# EasyEDA Pro project ProPrj_OrcaSDVX_电路.epro, schematic 主控板V2

## Sheets
1 P1: Board Name: 1-主控板V2; Create Date: 2025-03-24; Page Name: P1; Project Name: OrcaSDVX; Schematic Name: 主控板V2; Update Date: 2025-04-11; Company: 嘉立创EDA; Page Size: A3; Version: V1.0
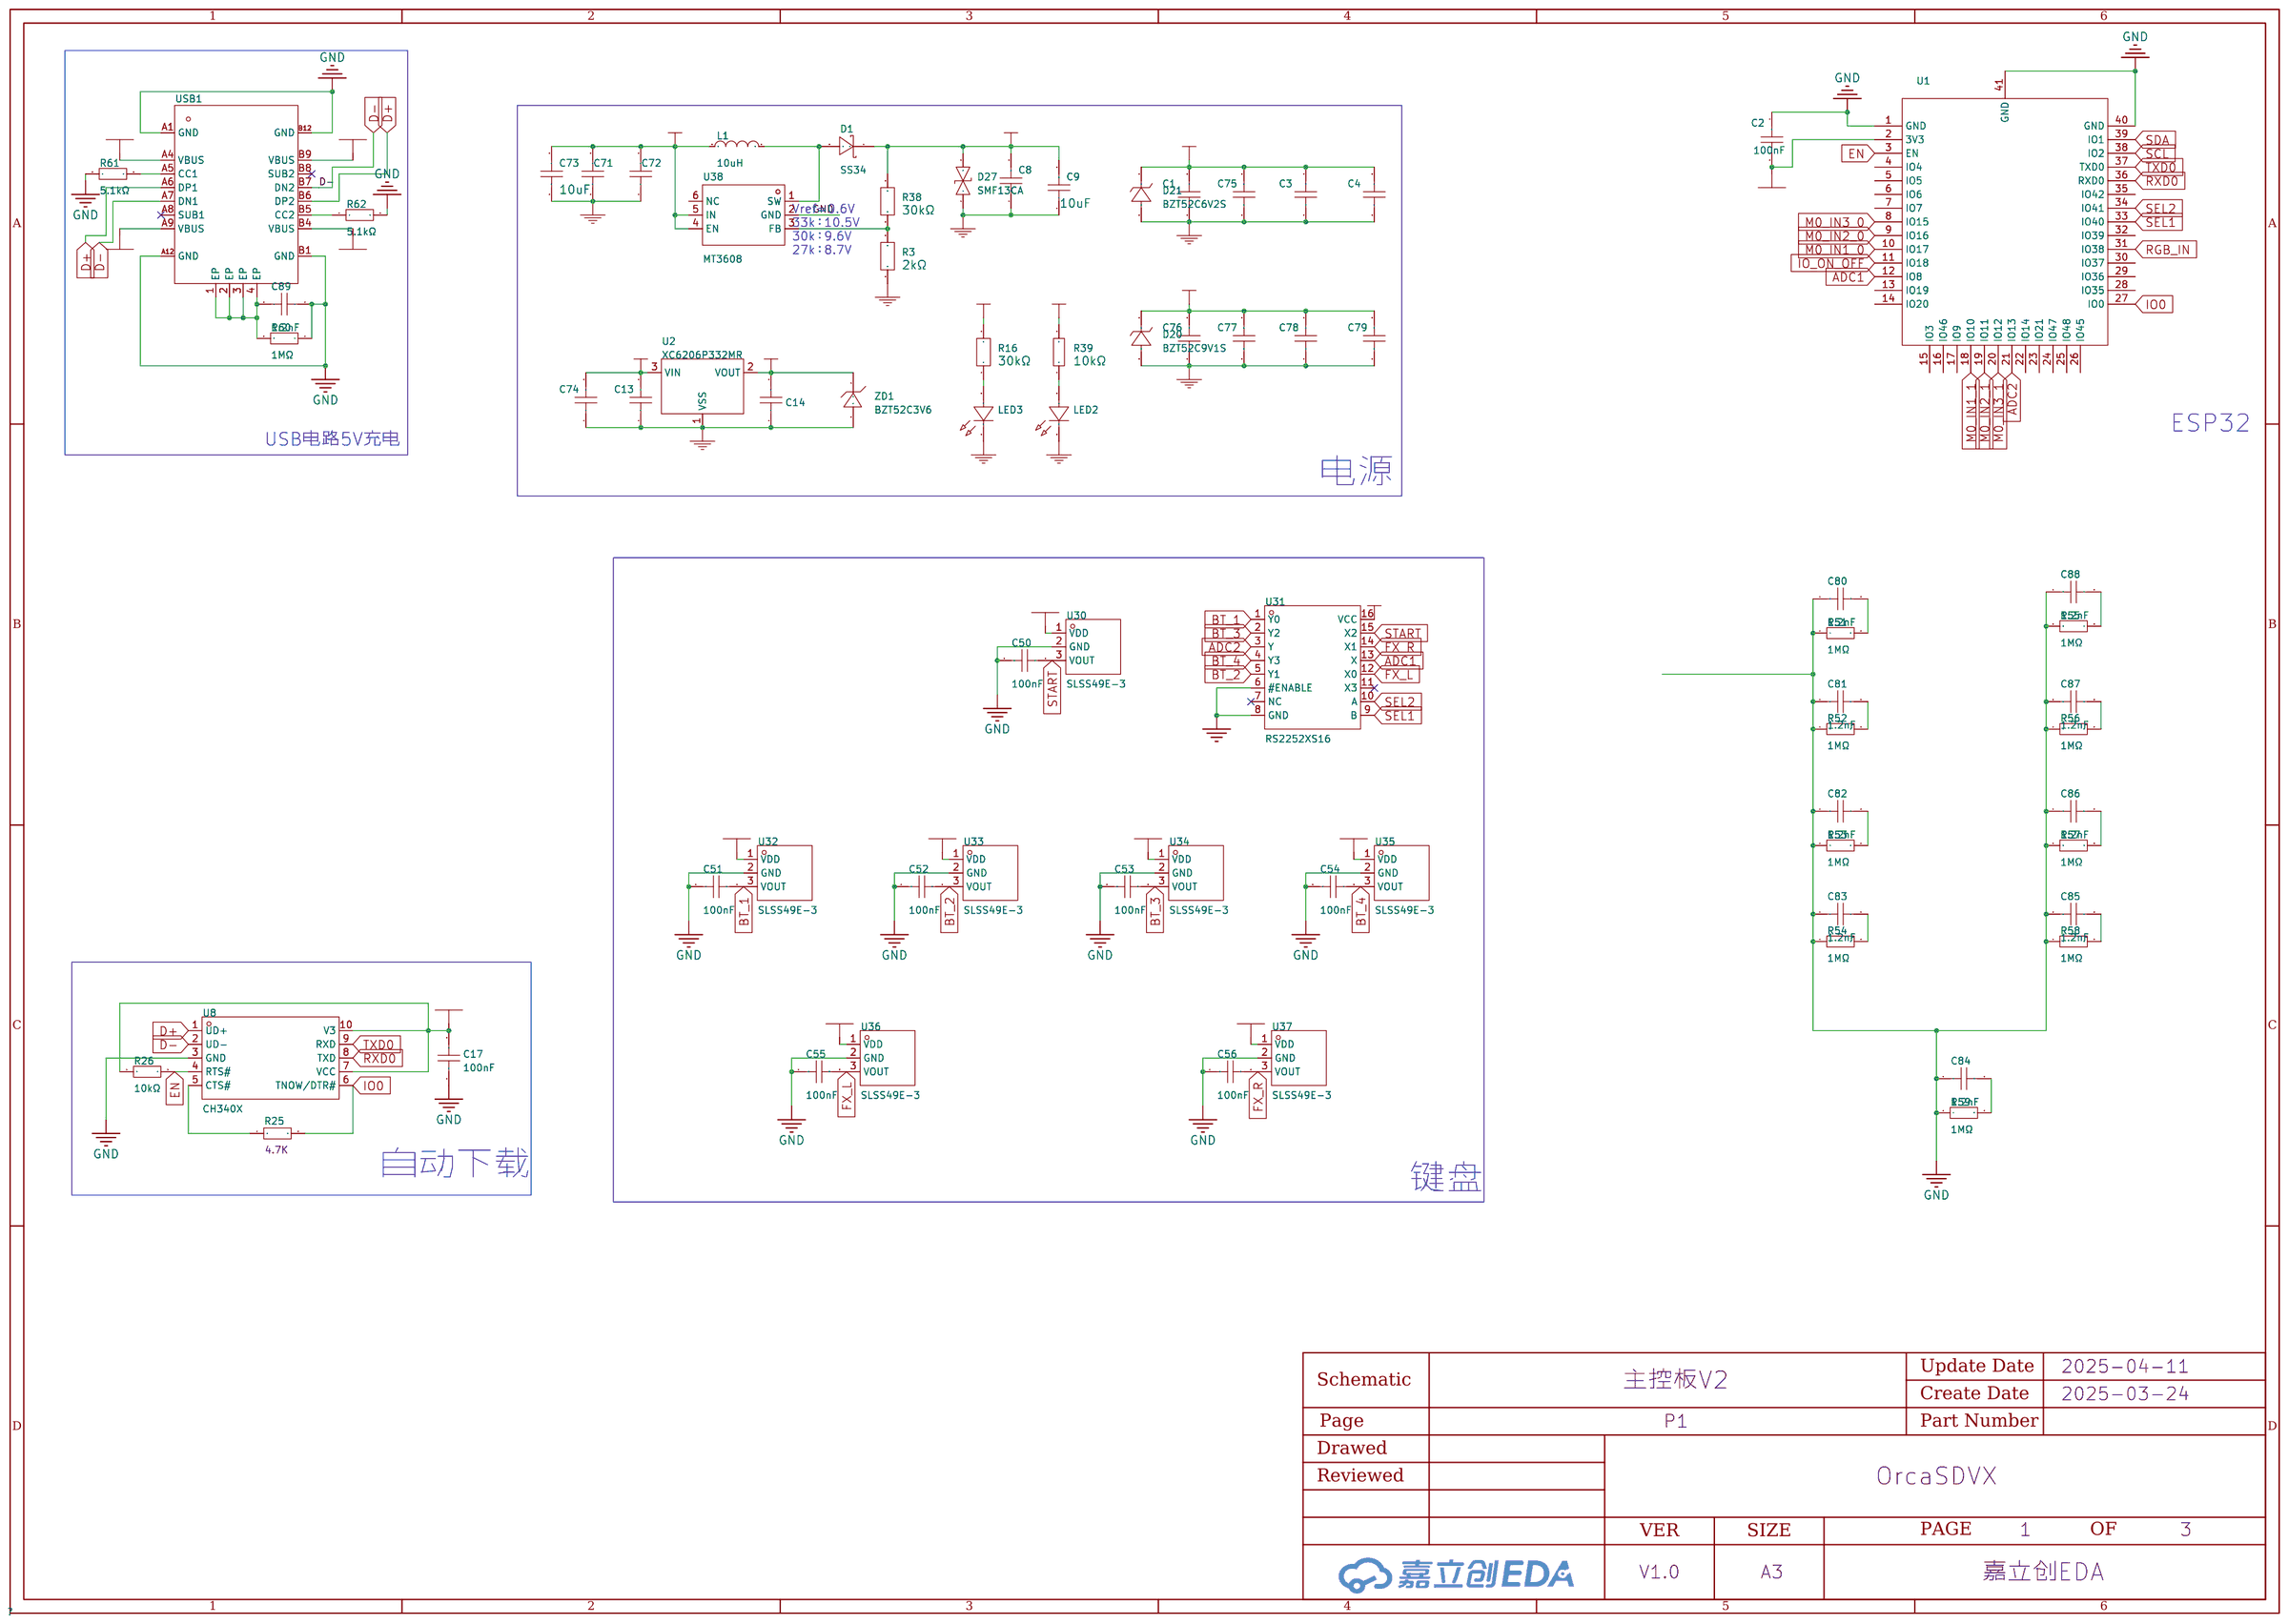
[diagram p0: P1]
2 电机驱动电路: Create Date: 2025-03-28; Page Name: 电机驱动电路; Update Date: 2025-04-10; Page Size: A4
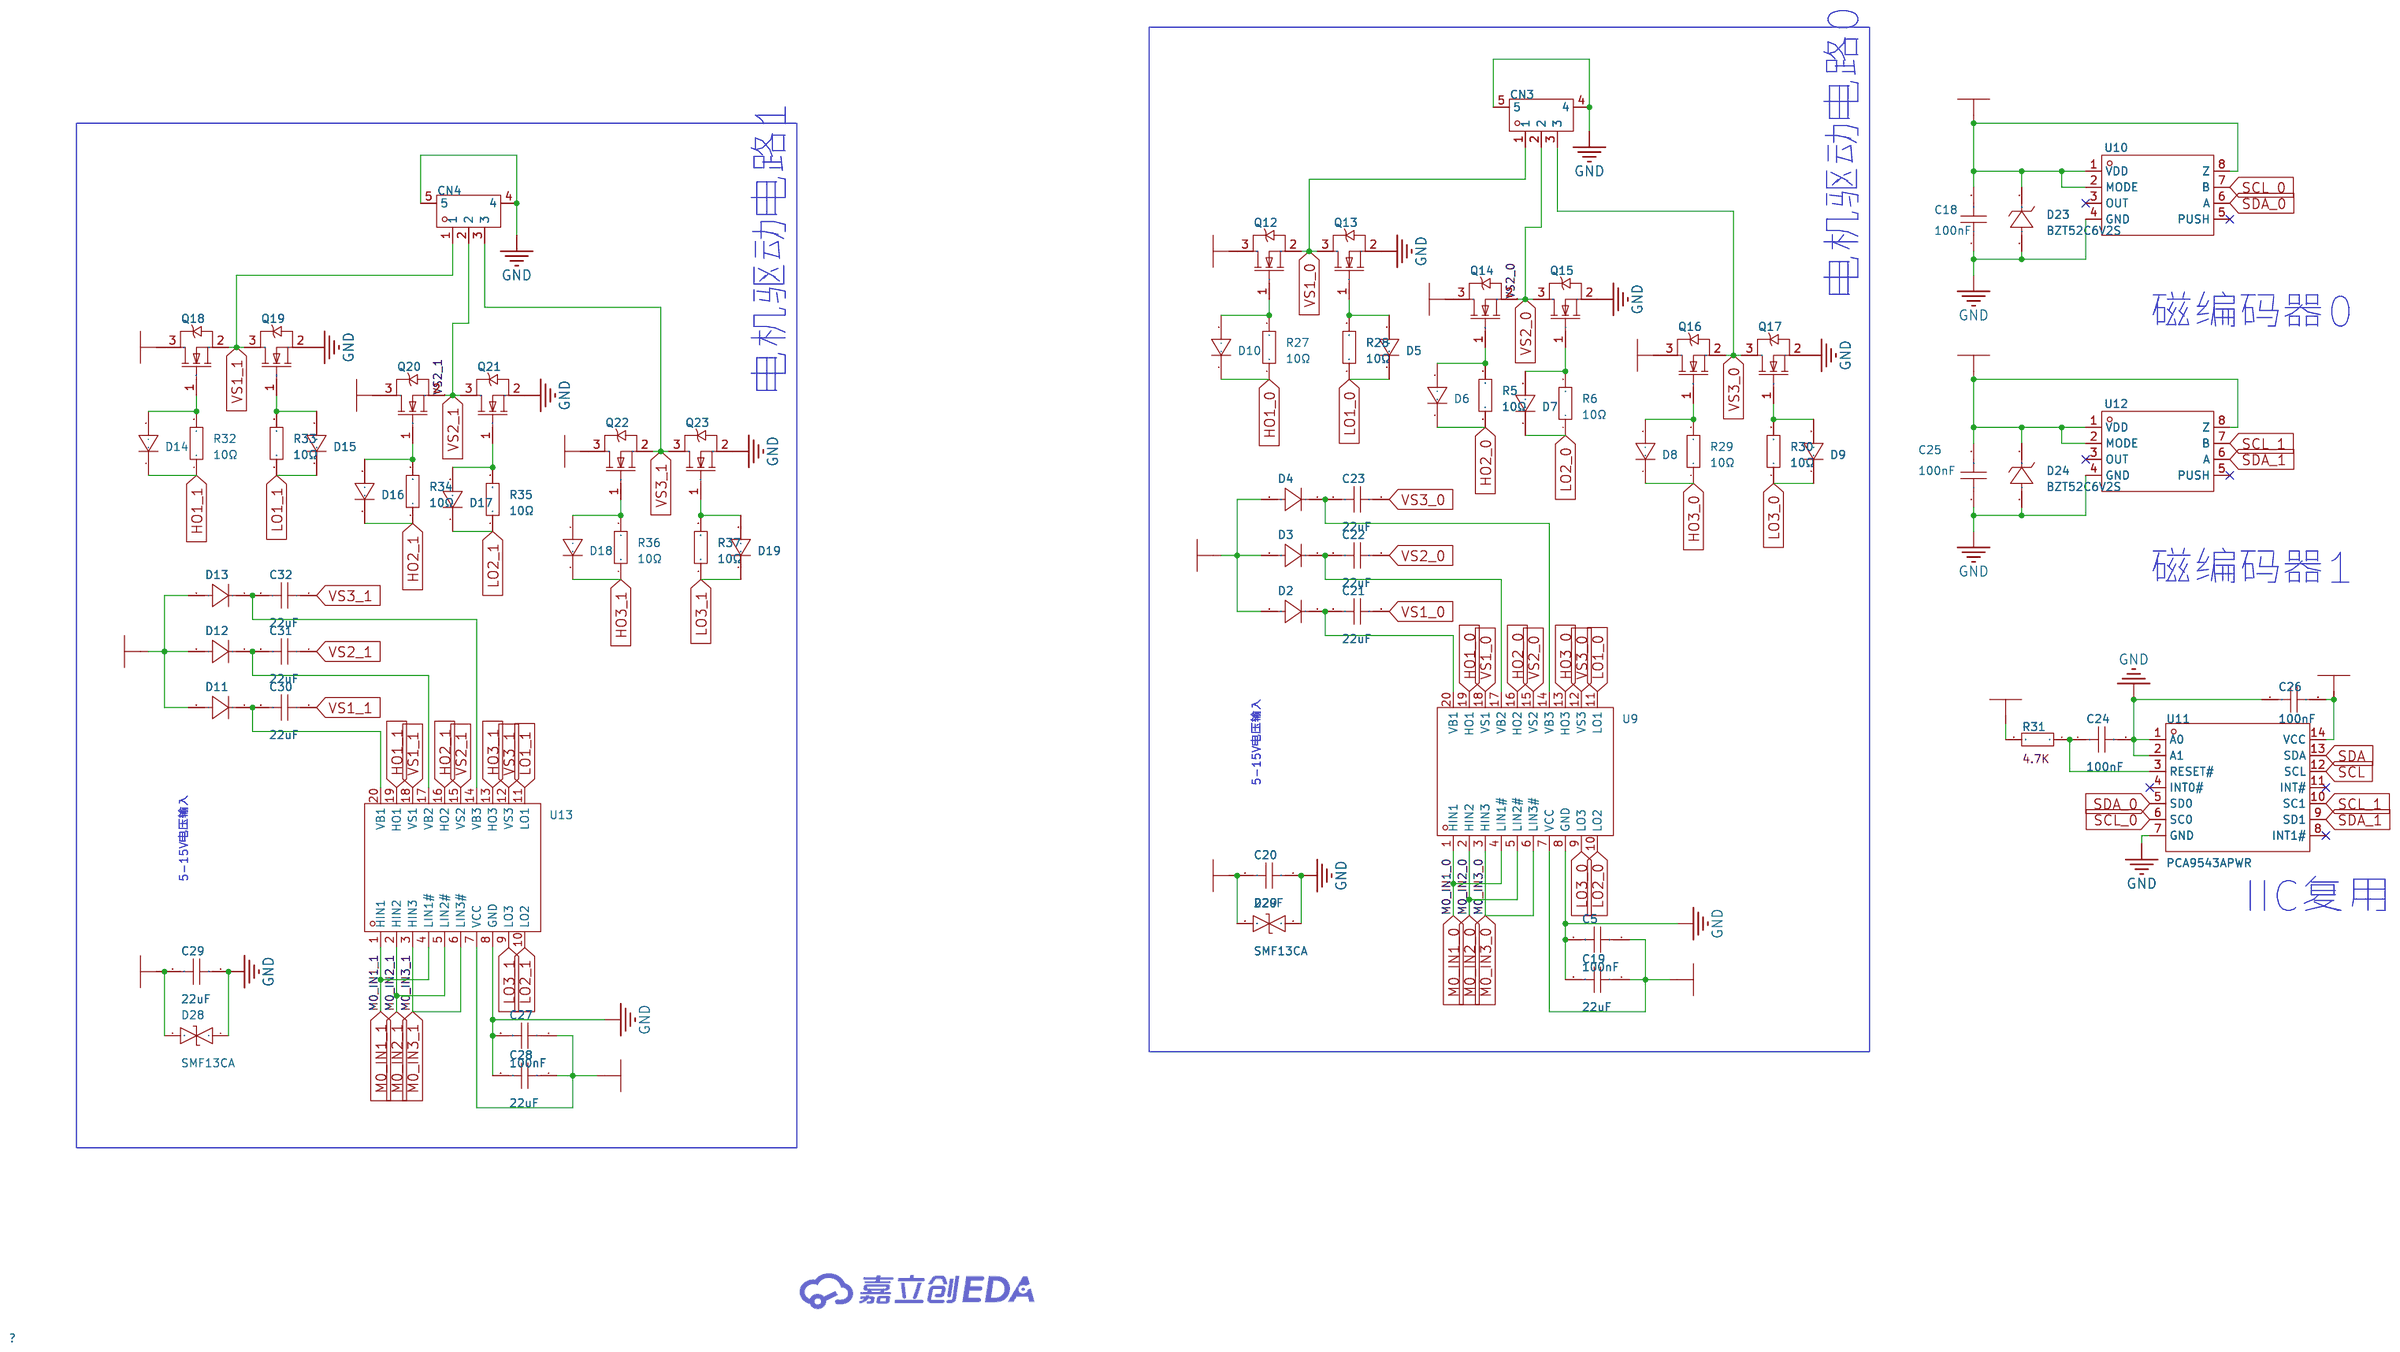
[diagram p1: 电机驱动电路]
3 灯: Create Date: 2025-03-28; Page Name: 灯; Project Name: OrcaSDVX_new; Update Date: 2025-03-28; Page Size: A4
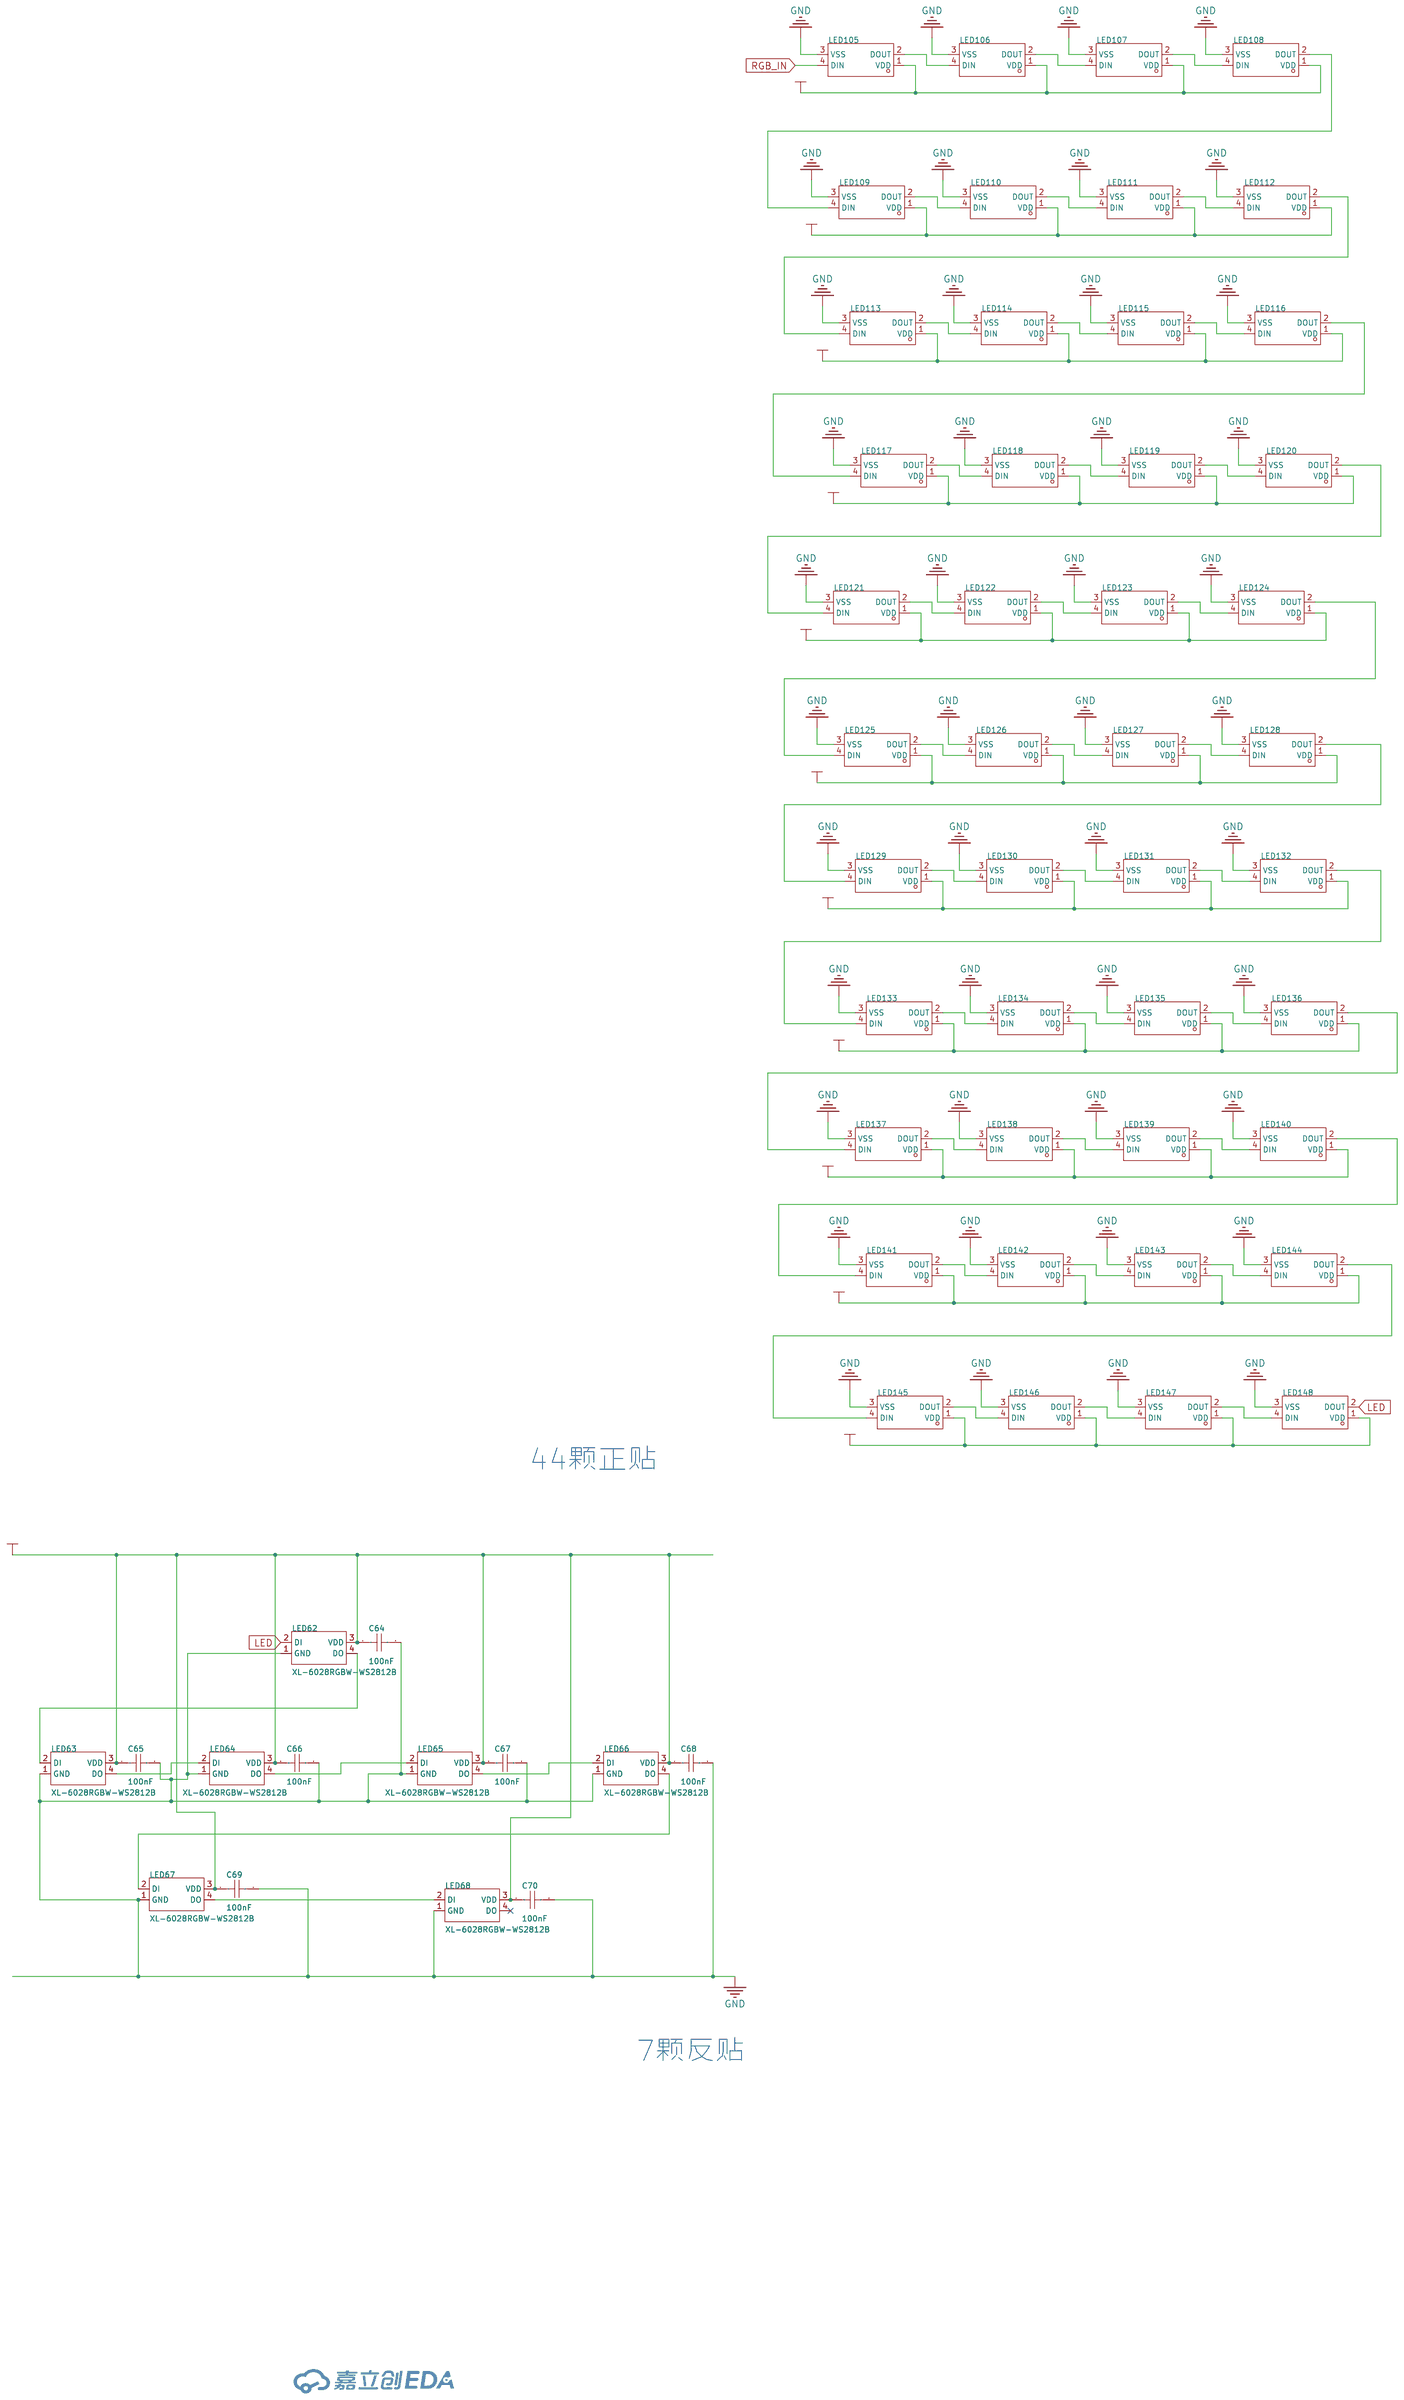
[diagram p2: 灯]

## Parts
sheet P1
C1  100nF  [C0402]
C2  100nF  [C0603]
C3  100nF  [C0402]
C4  100nF  [C0402]
C8  100nF  [C0402]
C9  10uF  [C0603]
C13  100nF  [C0402]
C14  100nF  [C0402]
C17  100nF  [C0603]
C50  100nF  [C0603]
C51  100nF  [C0603]
C52  100nF  [C0603]
C53  100nF  [C0603]
C54  100nF  [C0603]
C55  100nF  [C0603]
C56  100nF  [C0603]
C71  100nF  [C0402]
C72  100nF  [C0402]
C73  10uF  [C0603]
C74  100nF  [C0402]
C75  100nF  [C0402]
C76  100nF  [C0402]
C77  100nF  [C0402]
C78  100nF  [C0402]
C79  100nF  [C0402]
C80  1.2nF  [C1210]
C81  1.2nF  [C1210]
C82  1.2nF  [C1210]
C83  1.2nF  [C1210]
C84  1.2nF  [C1210]
C85  1.2nF  [C1210]
C86  1.2nF  [C1210]
C87  1.2nF  [C1210]
C88  1.2nF  [C1210]
C89  1.2nF  [C1210]
D1  SS34  [SMA_L4.3-W2.6-LS5.2-RD]
D20  BZT52C9V1S  [SOD-323_L1.7-W1.3-LS2.6-RD]
D21  BZT52C6V2S  [SOD-323_L1.7-W1.3-LS2.6-RD]
D27  SMF13CA  [SOD-123_L2.8-W1.8-LS3.7-BI-1]
L1  10uH  [IND-SMD_L3.0-W3.0_FTC303020D]
LED2  XL-1608UGC-04  [LED0603-RD_GREEN]
LED3  XL-1608UGC-04  [LED0603-RD_GREEN]
R3  2kΩ  [R0603]
R16  30kΩ  [R0603]
R25  -  [R0603]
R26  10kΩ  [R0603]
R38  30kΩ  [R0603]
R39  10kΩ  [R0402]
R51  1MΩ  [R2512]
R52  1MΩ  [R2512]
R53  1MΩ  [R2512]
R54  1MΩ  [R2512]
R55  1MΩ  [R2512]
R56  1MΩ  [R2512]
R57  1MΩ  [R2512]
R58  1MΩ  [R2512]
R59  1MΩ  [R2512]
R60  1MΩ  [R2512]
R61  5.1kΩ  [R0603]
R62  5.1kΩ  [R0603]
U1  ESP32-S3-WROOM-1U-N16R8  [WIRELM-SMD_ESP32-S3-WROOM-1U]
U2  XC6206P332MR  [SOT-23-3_L2.9-W1.3-P1.90-LS2.4-BR]
U8  CH340X  [MSOP-10_L3.0-W3.0-P0.50-LS5.0-BL]
U30  SLSS49E-3  [SOT-23-3_L2.9-W1.6-P1.90-LS2.8-BR-CW]
U31  RS2252XS16  [SOIC-16_L9.9-W3.9-P1.27-LS6.0-BL]
U32  SLSS49E-3  [SOT-23-3_L2.9-W1.6-P1.90-LS2.8-BR-CW]
U33  SLSS49E-3  [SOT-23-3_L2.9-W1.6-P1.90-LS2.8-BR-CW]
U34  SLSS49E-3  [SOT-23-3_L2.9-W1.6-P1.90-LS2.8-BR-CW]
U35  SLSS49E-3  [SOT-23-3_L2.9-W1.6-P1.90-LS2.8-BR-CW]
U36  SLSS49E-3  [SOT-23-3_L2.9-W1.6-P1.90-LS2.8-BR-CW]
U37  SLSS49E-3  [SOT-23-3_L2.9-W1.6-P1.90-LS2.8-BR-CW]
U38  MT3608  [SOT-23-6_L2.9-W1.6-P0.95-LS2.8-BL]
USB1  -  [USB-C-SMD_KH-TYPE-C-16P]
ZD1  BZT52C3V6  [SOD-123_L2.8-W1.8-LS3.7-RD]
sheet 灯
C64  100nF  [C0603]
C65  100nF  [C0603]
C66  100nF  [C0603]
C67  100nF  [C0603]
C68  100nF  [C0603]
C69  100nF  [C0603]
C70  100nF  [C0603]
LED62  XL-6028RGBW-WS2812B  [LED-SMD_4P-L3.2-W2.8-XL-6028RGBW-WS2812B]
LED63  XL-6028RGBW-WS2812B  [LED-SMD_4P-L3.2-W2.8-XL-6028RGBW-WS2812B]
LED64  XL-6028RGBW-WS2812B  [LED-SMD_4P-L3.2-W2.8-XL-6028RGBW-WS2812B]
LED65  XL-6028RGBW-WS2812B  [LED-SMD_4P-L3.2-W2.8-XL-6028RGBW-WS2812B]
LED66  XL-6028RGBW-WS2812B  [LED-SMD_4P-L3.2-W2.8-XL-6028RGBW-WS2812B]
LED67  XL-6028RGBW-WS2812B  [LED-SMD_4P-L3.2-W2.8-XL-6028RGBW-WS2812B]
LED68  XL-6028RGBW-WS2812B  [LED-SMD_4P-L3.2-W2.8-XL-6028RGBW-WS2812B]
LED105  WS2812B-Mini  [LED-SMD_4P-L3.5-W3.5-TL_WS2812B]
LED106  WS2812B-Mini  [LED-SMD_4P-L3.5-W3.5-TL_WS2812B]
LED107  WS2812B-Mini  [LED-SMD_4P-L3.5-W3.5-TL_WS2812B]
LED108  WS2812B-Mini  [LED-SMD_4P-L3.5-W3.5-TL_WS2812B]
LED109  WS2812B-Mini  [LED-SMD_4P-L3.5-W3.5-TL_WS2812B]
LED110  WS2812B-Mini  [LED-SMD_4P-L3.5-W3.5-TL_WS2812B]
LED111  WS2812B-Mini  [LED-SMD_4P-L3.5-W3.5-TL_WS2812B]
LED112  WS2812B-Mini  [LED-SMD_4P-L3.5-W3.5-TL_WS2812B]
LED113  WS2812B-Mini  [LED-SMD_4P-L3.5-W3.5-TL_WS2812B]
LED114  WS2812B-Mini  [LED-SMD_4P-L3.5-W3.5-TL_WS2812B]
LED115  WS2812B-Mini  [LED-SMD_4P-L3.5-W3.5-TL_WS2812B]
LED116  WS2812B-Mini  [LED-SMD_4P-L3.5-W3.5-TL_WS2812B]
LED117  WS2812B-Mini  [LED-SMD_4P-L3.5-W3.5-TL_WS2812B]
LED118  WS2812B-Mini  [LED-SMD_4P-L3.5-W3.5-TL_WS2812B]
LED119  WS2812B-Mini  [LED-SMD_4P-L3.5-W3.5-TL_WS2812B]
LED120  WS2812B-Mini  [LED-SMD_4P-L3.5-W3.5-TL_WS2812B]
LED121  WS2812B-Mini  [LED-SMD_4P-L3.5-W3.5-TL_WS2812B]
LED122  WS2812B-Mini  [LED-SMD_4P-L3.5-W3.5-TL_WS2812B]
LED123  WS2812B-Mini  [LED-SMD_4P-L3.5-W3.5-TL_WS2812B]
LED124  WS2812B-Mini  [LED-SMD_4P-L3.5-W3.5-TL_WS2812B]
LED125  WS2812B-Mini  [LED-SMD_4P-L3.5-W3.5-TL_WS2812B]
LED126  WS2812B-Mini  [LED-SMD_4P-L3.5-W3.5-TL_WS2812B]
LED127  WS2812B-Mini  [LED-SMD_4P-L3.5-W3.5-TL_WS2812B]
LED128  WS2812B-Mini  [LED-SMD_4P-L3.5-W3.5-TL_WS2812B]
LED129  WS2812B-Mini  [LED-SMD_4P-L3.5-W3.5-TL_WS2812B]
LED130  WS2812B-Mini  [LED-SMD_4P-L3.5-W3.5-TL_WS2812B]
LED131  WS2812B-Mini  [LED-SMD_4P-L3.5-W3.5-TL_WS2812B]
LED132  WS2812B-Mini  [LED-SMD_4P-L3.5-W3.5-TL_WS2812B]
LED133  WS2812B-Mini  [LED-SMD_4P-L3.5-W3.5-TL_WS2812B]
LED134  WS2812B-Mini  [LED-SMD_4P-L3.5-W3.5-TL_WS2812B]
LED135  WS2812B-Mini  [LED-SMD_4P-L3.5-W3.5-TL_WS2812B]
LED136  WS2812B-Mini  [LED-SMD_4P-L3.5-W3.5-TL_WS2812B]
LED137  WS2812B-Mini  [LED-SMD_4P-L3.5-W3.5-TL_WS2812B]
LED138  WS2812B-Mini  [LED-SMD_4P-L3.5-W3.5-TL_WS2812B]
LED139  WS2812B-Mini  [LED-SMD_4P-L3.5-W3.5-TL_WS2812B]
LED140  WS2812B-Mini  [LED-SMD_4P-L3.5-W3.5-TL_WS2812B]
LED141  WS2812B-Mini  [LED-SMD_4P-L3.5-W3.5-TL_WS2812B]
LED142  WS2812B-Mini  [LED-SMD_4P-L3.5-W3.5-TL_WS2812B]
LED143  WS2812B-Mini  [LED-SMD_4P-L3.5-W3.5-TL_WS2812B]
LED144  WS2812B-Mini  [LED-SMD_4P-L3.5-W3.5-TL_WS2812B]
LED145  WS2812B-Mini  [LED-SMD_4P-L3.5-W3.5-TL_WS2812B]
LED146  WS2812B-Mini  [LED-SMD_4P-L3.5-W3.5-TL_WS2812B]
LED147  WS2812B-Mini  [LED-SMD_4P-L3.5-W3.5-TL_WS2812B]
LED148  WS2812B-Mini  [LED-SMD_4P-L3.5-W3.5-TL_WS2812B]
sheet 电机驱动电路
C5  100nF  [C0603]
C18  100nF  [C0603]
C19  22uF  [C0805]
C20  22uF  [C0805]
C21  22uF  [C0805]
C22  22uF  [C0805]
C23  22uF  [C0805]
C24  100nF  [C0603]
C25  100nF  [C0603]
C26  100nF  [C0603]
C27  100nF  [C0603]
C28  22uF  [C0805]
C29  22uF  [C0805]
C30  22uF  [C0805]
C31  22uF  [C0805]
C32  22uF  [C0805]
CN3  -  [CONN-SMD_X0800WRS-03HF-LPV01]
CN4  -  [CONN-SMD_X0800WRS-03HF-LPV01]
D2  -  [SOD-123FL_L2.7-W1.8-LS3.8-RD]
D3  -  [SOD-123FL_L2.7-W1.8-LS3.8-RD]
D4  -  [SOD-123FL_L2.7-W1.8-LS3.8-RD]
D5  -  [SOD-123F_L2.7-W1.6-LS3.8-RD]
D6  -  [SOD-123F_L2.7-W1.6-LS3.8-RD]
D7  -  [SOD-123F_L2.7-W1.6-LS3.8-RD]
D8  -  [SOD-123F_L2.7-W1.6-LS3.8-RD]
D9  -  [SOD-123F_L2.7-W1.6-LS3.8-RD]
D10  -  [SOD-123F_L2.7-W1.6-LS3.8-RD]
D11  -  [SOD-123FL_L2.7-W1.8-LS3.8-RD]
D12  -  [SOD-123FL_L2.7-W1.8-LS3.8-RD]
D13  -  [SOD-123FL_L2.7-W1.8-LS3.8-RD]
D14  -  [SOD-123F_L2.7-W1.6-LS3.8-RD]
D15  -  [SOD-123F_L2.7-W1.6-LS3.8-RD]
D16  -  [SOD-123F_L2.7-W1.6-LS3.8-RD]
D17  -  [SOD-123F_L2.7-W1.6-LS3.8-RD]
D18  -  [SOD-123F_L2.7-W1.6-LS3.8-RD]
D19  -  [SOD-123F_L2.7-W1.6-LS3.8-RD]
D23  BZT52C6V2S  [SOD-323_L1.7-W1.3-LS2.6-RD]
D24  BZT52C6V2S  [SOD-323_L1.7-W1.3-LS2.6-RD]
D28  SMF13CA  [SOD-123_L2.8-W1.8-LS3.7-BI-1]
D29  SMF13CA  [SOD-123_L2.8-W1.8-LS3.7-BI-1]
Q12  -  [SOT-23-3_L2.9-W1.3-P0.95-LS2.4-BR]
Q13  -  [SOT-23-3_L2.9-W1.3-P0.95-LS2.4-BR]
Q14  -  [SOT-23-3_L2.9-W1.3-P0.95-LS2.4-BR]
Q15  -  [SOT-23-3_L2.9-W1.3-P0.95-LS2.4-BR]
Q16  -  [SOT-23-3_L2.9-W1.3-P0.95-LS2.4-BR]
Q17  -  [SOT-23-3_L2.9-W1.3-P0.95-LS2.4-BR]
Q18  -  [SOT-23-3_L2.9-W1.3-P0.95-LS2.4-BR]
Q19  -  [SOT-23-3_L2.9-W1.3-P0.95-LS2.4-BR]
Q20  -  [SOT-23-3_L2.9-W1.3-P0.95-LS2.4-BR]
Q21  -  [SOT-23-3_L2.9-W1.3-P0.95-LS2.4-BR]
Q22  -  [SOT-23-3_L2.9-W1.3-P0.95-LS2.4-BR]
Q23  -  [SOT-23-3_L2.9-W1.3-P0.95-LS2.4-BR]
R5  10Ω  [R0603]
R6  10Ω  [R0603]
R27  10Ω  [R0603]
R28  10Ω  [R0603]
R29  10Ω  [R0603]
R30  10Ω  [R0603]
R31  -  [R0603]
R32  10Ω  [R0603]
R33  10Ω  [R0603]
R34  10Ω  [R0603]
R35  10Ω  [R0603]
R36  10Ω  [R0603]
R37  10Ω  [R0603]
U9  -  [TSSOP-20_L6.5-W4.4-P0.65-LS6.4-BL]
U10  -  [SOP-8_L4.9-W3.9-P1.27-LS6.0-BL]
U11  PCA9543APWR  [TSSOP-14_L5.0-W4.4-P0.65-LS6.4-BL]
U12  -  [SOP-8_L4.9-W3.9-P1.27-LS6.0-BL]
U13  -  [TSSOP-20_L6.5-W4.4-P0.65-LS6.4-BL]

## Library data of the parts
C1 C3 C4 C8 C13 C14 C74-C79 = GRM155R71H104KE14D: 容值:100nF;精度:±10%;额定电压:50V;材质(温度系数):X7R;; LCSC Part Name: 100nF ±10% 50V; Supplier Part: C77020; Manufacturer: muRata(村田); Supplier Footprint: 0402; JLCPCB Part Class: Extended Part; Datasheet: https://atta.szlcsc.com/upload/public/pdf/source/20180326/C77020_39BD49C951FF1AF0DB1F1FAC5AC1E401.pdf; Supplier: LCSC; Tolerance: ±10%; Voltage Rated: 50V; Temperature Coefficient: X7R; JLCPCB SMD: Yes
C2 C17 C24 = CC0603KRX7R9BB104: 容值:100nF;精度:±10%;额定电压:50V;温度系数:X7R;; LCSC Part Name: 100nF ±10% 50V; Supplier Part: C14663; Manufacturer: YAGEO(国巨); Supplier Footprint: 0603; JLCPCB Part Class: Basic Part; Datasheet: https://atta.szlcsc.com/upload/public/pdf/source/20170116/1484561234239.pdf; Supplier: LCSC; Tolerance: ±10%; Voltage Rated: 50V; Temperature Coefficient: X7R
C9 C73 = CL10A106MA8NRNC: 容值:10uF;精度:±20%;额定电压:25V;材质(温度系数):X5R;; LCSC Part Name: 10uF ±20% 25V; Supplier Part: C96446; Manufacturer: SAMSUNG(三星); Supplier Footprint: 0603; JLCPCB Part Class: Basic Part; Datasheet: https://atta.szlcsc.com/upload/public/pdf/source/20160218/1457707763339.pdf; Supplier: LCSC; Tolerance: ±20%; Voltage Rated: 25V; Temperature Coefficient: X5R
C50-C56 C64-C70 = CGA0603X7R104K500JT: 容值:100nF;精度:±10%;额定电压:50V;温度系数:X7R;; LCSC Part Name: 100nF ±10% 50V; Supplier Part: C6119867; Manufacturer: HRE(芯声); Supplier Footprint: 0603; JLCPCB Part Class: 扩展库; Datasheet: https://atta.szlcsc.com/upload/public/pdf/source/20250103/C44077DA9E7B3EFAE02F22B6D3D1CBC9.pdf; Supplier: LCSC; Tolerance: ±10%; Voltage Rating: 50V; Temperature Coefficient: X7R
C71 C72 = GRM155R71H104KE14D: 容值:100nF;精度:±10%;额定电压:50V;材质(温度系数):X7R;; LCSC Part Name: 100nF ±10% 50V; Supplier Part: C77020; Manufacturer: muRata(村田); Supplier Footprint: 0402; JLCPCB Part Class: Extended Part; Datasheet: https://atta.szlcsc.com/upload/public/pdf/source/20180326/C77020_39BD49C951FF1AF0DB1F1FAC5AC1E401.pdf; Supplier: LCSC; Tolerance: ±10%; Voltage Rated: 50V; Temperature Coefficient: X7R
C80-C89 = FV32N122J102EEG: 容值:1.2nF;精度:±5%;额定电压:1kV;温度系数:C0G;; LCSC Part Name: 1.2nF ±5% 1kV; Supplier Part: C5795623; Manufacturer: PSA(信昌电陶); Supplier Footprint: 1210; JLCPCB Part Class: 扩展库; Datasheet: https://atta.szlcsc.com/upload/public/pdf/source/20230505/CF9BCD5E9604D80023FEB757933517A4.pdf; Supplier: LCSC; Tolerance: ±5%; Voltage Rating: 1kV; Temperature Coefficient: C0G
D1 = SS34_C8678: 二极管配置:独立式;正向压降(Vf):550mV@3A;直流反向耐压(Vr):40V;整流电流:3A;; LCSC Part Name: 电压:40V 电流:3A; Supplier Part: C8678; Manufacturer: MDD(辰达半导体); Supplier Footprint: SMA(DO-214AC); JLCPCB Part Class: 基础库; Datasheet: https://atta.szlcsc.com/upload/public/pdf/source/20230314/A80AE34493C69B89E2F4B1712F433538.pdf; Supplier: LCSC; Diode Configuration: 独立式; Forward Voltage (Vf@If): 550mV@3A; Reverse Voltage (Vr): 40V; Rectified Current: 3A; Reverse Leakage Current (Ir): 500uA@40V
D20 = BZT52C9V1S_C19077445: 二极管配置:独立式;稳压值(标称值):9.1V;稳压值(范围):8.5V~9.6V;耗散功率(Pd):200mW;; Supplier Part: C19077445; Manufacturer: 宏嘉诚; Supplier Footprint: SOD-323; JLCPCB Part Class: 扩展库; Datasheet: https://atta.szlcsc.com/upload/public/pdf/source/20250106/7E1D90346C4882705F28E5010261A625.pdf; Supplier: LCSC; Diode Configuration: 独立式; Zener Voltage(Nom): 9.1V; Reverse Leakage Current (Ir): 500nA@6V; Zener Voltage(Range): 8.5V~9.6V; Pd - Power Dissipation(Pd): 200mW; Impedance(Zzt): 15Ω
D21 D23 D24 = BZT52C6V2S_C19077442: 二极管配置:独立式;稳压值(标称值):6.2V;稳压值(范围):5.8V~6.2V;功率(Pd):200mW;; Supplier Part: C19077442; Manufacturer: 宏迦橙; Supplier Footprint: SOD-323; JLCPCB Part Class: 扩展库; Datasheet: https://atta.szlcsc.com/upload/public/pdf/source/20231117/06CD1C2A69B3FFC97FEAE4263E1B2FE9.pdf; Supplier: LCSC; Diode Configuration: 独立式; Zener Voltage (Nom): 6.2V; Reverse Leakage Current (Ir): 3uA@4V; Zener Voltage (Range): 5.8V~6.2V; Power Dissipation: 200mW; Zener Impedance (Zzt): 10Ω
D27-D29 = SMF13CA_C5693166: 极性:双向;反向截止电压(Vrwm):13V;钳位电压:21.5V;峰值脉冲电流(Ipp):9.3A;峰值脉冲功率(Ppp):200W;击穿电压:14.4V;; LCSC Part Name: 最大耗散功率(W) 200 最大抵消电压(V) 13; Supplier Part: C5693166; Manufacturer: ElecSuper(静芯微); Supplier Footprint: SOD123FL; JLCPCB Part Class: 扩展库; Datasheet: https://atta.szlcsc.com/upload/public/pdf/source/20240319/016812F8BB7F50C10BCC6636F2E2C816.pdf; Supplier: LCSC; Polarity: 双向; Reverse Stand-Off Voltage (Vrwm): 13V; Clamping Voltage: 21.5V; Peak Pulse Current (Ipp): 9.3A; Peak Pulse Power Dissipation (Ppp): 200W; Voltage - Breakdown: 14.4V; Reverse Leakage Current (Ir): 1uA; Number of Channels: 单路; Type: TVS
L1 = FTC303020D100MBCA: 电感值:10uH;精度:±20%;额定电流:2.5A;饱和电流(Isat):3.8A;类型:一体成型电感;; LCSC Part Name: 10uH ±20% 3.8A; Supplier Part: C7423323; Manufacturer: cjiang(长江微电); Supplier Footprint: SMD,3x3mm; JLCPCB Part Class: Extended Part; Datasheet: https://atta.szlcsc.com/upload/public/pdf/source/20230614/D39208D019DF4F1446B96572E3A14872.pdf; Supplier: LCSC; Tolerance: ±20%; Rated Current: 2.5A; Saturation Current (Isat): 3.8A; DC Resistance (DCR): 135mΩ; Type: 一体成型电感
LED2 LED3 = XL-1608UGC-04: 灯头类型:-;发光颜色:翠绿色;正向电压(VF):-;功率:80mW;正向电流:25mA;主波长:516nm~525nm;二极管配置:独立二极管;透镜颜色:无色透明透镜;色温:-;发光强度:-;发光角度:120°;载带方式:正贴;工作温度:-30℃~+85℃;; Supplier Part: C965804; Manufacturer: XINGLIGHT(成兴光); Supplier Footprint: 0603; JLCPCB Part Class: Extended Part; Datasheet: https://atta.szlcsc.com/upload/public/pdf/source/20221102/520D6E465E5CFD1609C8A4DBC80D4018.pdf; Supplier: LCSC; Emitted Color: 翠绿色; Power Dissipation: 80mW; Forward Current: 25mA; Dominant Wavelength: 516nm~525nm; Peak Wavelength: 534nm; Diode Configuration: 独立二极管; Lens Color: 无色透明透镜; Viewing Angle: 120°; Mounting Sytle: 正贴; Operating Temperature: -30℃~+85℃
R3 = 0603WAF2001T5E: 精度:±1%;阻值:2kΩ;温度系数:±100ppm/℃;功率:1/10W;最大工作电压:75V;工作温度范围:-55℃~+155℃;; LCSC Part Name: 2KΩ ±1%; Supplier Part: C22975; Manufacturer: UNI-ROYAL(厚声); Supplier Footprint: 0603; JLCPCB Part Class: Basic Part; Datasheet: https://atta.szlcsc.com/upload/public/pdf/source/20170920/C22975_1505901012894982362.pdf; Supplier: LCSC; Tolerance: ±1%; Temperature Coefficient: ±100ppm/℃; Power(Watts): 1/10W; Overload Voltage (Max): 75V; Operating Temperature Range: -55℃~+155℃
R16 R38 = 0603WAF3002T5E: 电阻类型:厚膜电阻;阻值:30kΩ;精度:±1%;功率:100mW;最大工作电压:75V;温度系数:±100ppm/℃;; LCSC Part Name: 30kΩ ±1% 100mW 厚膜电阻; Supplier Part: C22984; Manufacturer: UNI-ROYAL(厚声); Supplier Footprint: 0603; JLCPCB Part Class: Basic Part; Datasheet: https://atta.szlcsc.com/upload/public/pdf/source/20200306/C422600_1E6D84923E4A46A82E41ADD87F860B5C.pdf; Supplier: LCSC; Type: 厚膜电阻; Tolerance: ±1%; Power(Watts): 100mW; Overload Voltage (Max): 75V; Temperature Coefficient: ±100ppm/℃; Operating Temperature Range: -55℃~+155℃
R25 R31 = 0603WAF4701T5E: 4.7K; LCSC Part Name: 4.7KΩ(4701) ±1% 编带; Supplier Part: C23162; Manufacturer: UNI-ROYAL(厚声); Supplier Footprint: 0603; JLCPCB Part Class: Basic Part; Datasheet: https://atta.szlcsc.com/upload/public/pdf/source/20170920/C23162_1505901109673982545.pdf; Supplier: LCSC
R26 = 0603WAF1002T5E: 电阻类型:厚膜电阻;阻值:10kΩ;精度:±1%;功率:1/10W;温度系数:±100ppm/;最大工作电压:75V;工作温度范围:-55~+155;; LCSC Part Name: 10kΩ ±1% 1/10W; Supplier Part: C25804; Manufacturer: UNI-ROYAL(厚声); Supplier Footprint: 0603; JLCPCB Part Class: Basic Part; Datasheet: https://atta.szlcsc.com/upload/public/pdf/source/20200306/C422600_1E6D84923E4A46A82E41ADD87F860B5C.pdf; Supplier: LCSC; Type: 厚膜电阻; Tolerance: ±1%; Power(Watts): 1/10W; Temperature Coefficient: ±100ppm/; Overload Voltage (Max): 75V; Operating Temperature Range: -55~+155
R39 = RC0402FR-0710KL: 电阻类型:厚膜电阻;阻值:10kΩ;精度:±1%;功率:62.5mW;最大工作电压:50V;温度系数:±100ppm/℃;; LCSC Part Name: 厚膜电阻 10kΩ ±1% 62.5mW; Supplier Part: C60490; Manufacturer: YAGEO(国巨); Supplier Footprint: 0402; JLCPCB Part Class: Extended Part; Datasheet: https://atta.szlcsc.com/upload/public/pdf/source/20170925/C131467_1506321478108990263.pdf; Supplier: LCSC; Type: 厚膜电阻; Tolerance: ±1%; Power(Watts): 62.5mW; Overload Voltage (Max): 50V; Temperature Coefficient: ±100ppm/℃; Operating Temperature Range: -55℃~+155℃
R51-R60 = HR2512F1M00E04Z: 电阻类型:厚膜电阻;阻值:1MΩ;精度:±1%;功率:1W;最大工作电压:800V;; LCSC Part Name: 厚膜电阻 1MΩ ±1% 1W; Supplier Part: C175531; Manufacturer: EVER OHMS(天二科技); Supplier Footprint: 2512; JLCPCB Part Class: 扩展库; Datasheet: https://atta.szlcsc.com/upload/public/pdf/source/20190725/C376175_D341F0D984926FE2405AA3E5B4E53DA1.pdf; Supplier: LCSC; Type: 厚膜电阻; Tolerance: ±1%; Power(Watts): 1W; Overload Voltage (Max): 800V; Operating Temperature Range: -55℃~+155℃
R61 R62 = 0603WAF5101T5E: 电阻类型:厚膜电阻;阻值:5.1kΩ;精度:±1%;功率:100mW;最大工作电压:75V;温度系数:±100ppm/℃;; LCSC Part Name: 5.1kΩ ±1% 100mW 厚膜电阻; Supplier Part: C23186; Manufacturer: UNI-ROYAL(厚声); Supplier Footprint: 0603; JLCPCB Part Class: 基础库; Datasheet: https://atta.szlcsc.com/upload/public/pdf/source/20200306/C422600_1E6D84923E4A46A82E41ADD87F860B5C.pdf; Supplier: LCSC; Type: 厚膜电阻; Tolerance: ±1%; Power(Watts): 100mW; Overload Voltage (Max): 75V; Temperature Coefficient: ±100ppm/℃; Operating Temperature Range: -55℃~+155℃
U1 = ESP32-S3-WROOM-1U-N16R8: Supplier Part: C3013946; Manufacturer: ESPRESSIF(乐鑫); Supplier Footprint: SMD,18x19.2mm; JLCPCB Part Class: Extended Part; Datasheet: https://atta.szlcsc.com/upload/public/pdf/source/20240130/9D71F4DF55874C504AB629FEEE3F038E.pdf; Supplier: LCSC
U2 = XC6206P332MR_C5148692: 输出类型:固定;最大输入电压:8V;输出电压:3.3V;最大输出电流:300mA;输出极性:正极;; LCSC Part Name: 输入8V 输出3.3V 300mA; Supplier Part: C5148692; Manufacturer: HXY MOSFET(华轩阳电子); Supplier Footprint: SOT-23; JLCPCB Part Class: 扩展库; Datasheet: https://atta.szlcsc.com/upload/public/pdf/source/20230315/7D5B35EFFBBF81C2EFC36318D2A1A670.pdf; Supplier: LCSC; Output Type: 固定; Maximum Input Voltage: 8V; Output Voltage: 3.3V; MAX Output Current: 300mA; Dropout Voltage: 240mV@(50mA); Output Polarity: 正极; Number of Outputs: 1
U8 = CH340X: Supplier Part: C3035748; Manufacturer: WCH(南京沁恒); Supplier Footprint: MSOP-10; JLCPCB Part Class: Extended Part; Datasheet: https://atta.szlcsc.com/upload/public/pdf/source/20230530/6E401E9554E9F5311886CC8B3F89B62E.pdf; Supplier: LCSC
U30 U32-U37 = SLSS49E-3: Supplier Part: C2904393; Manufacturer: Slkor(萨科微); Supplier Footprint: SOT-23; JLCPCB Part Class: 扩展库; Datasheet: https://atta.szlcsc.com/upload/public/pdf/source/20211008/7CEDD8851A4D4849984AB88876F122B3.pdf; Supplier: LCSC
U31 = RS2252XS16: 2通道4选1复用器; LCSC Part Name: 模拟开关RS2252XS16; Supplier Part: C255481; Manufacturer: RUNIC(润石); Supplier Footprint: SOIC-16; JLCPCB Part Class: Extended Part; Datasheet: https://atta.szlcsc.com/upload/public/pdf/watermark/20190926/C255481_D8BB75A2CD52039850480E219AD25749.pdf; Supplier: LCSC
U38 = MT3608: 功能类型:升压型;输入电压:2V~24V;输出电压:28V;输出电流(最大值):-;; Supplier Part: C84817; Manufacturer: 西安航天民芯; Supplier Footprint: SOT-23-6; JLCPCB Part Class: 扩展库; Datasheet: https://atta.szlcsc.com/upload/public/pdf/source/20161110/1478743351706.pdf; Supplier: LCSC; Function: 升压型; Input Voltage: 2V~24V; Output Voltage: 28V; Switching Frequency: 1.2MHz; Number of Outputs: 1; Topology: 升压式; Switch tube (built-in/external): 内置
USB1 = KH-TYPE-C-16P: 连接器类型:Type-C;标准:-;公母:母座;触点数量:16;端口数量:1;安装方式:卧贴;额定电流 - 电源:3A;工作温度范围:-40~+85;; LCSC Part Name: Type-C 母座 卧贴; Supplier Part: C709357; Manufacturer: kinghelm(金航标); Supplier Footprint: SMD; JLCPCB Part Class: Extended Part; Datasheet: https://atta.szlcsc.com/upload/public/pdf/source/20200911/C709357_AA8DCEB38BB20E3035A7ED7AE7667837.pdf; Supplier: LCSC; Connector Type: Type-C; Gender: 母座; Number of Contacts: 16; Number of Ports: 1; Mounting Style: 卧贴; Current Rating - Power (Max): 3A; Operating Temperature Range: -40~+85
ZD1 = BZT52C3V6_C2113: 二极管配置:独立式;稳压值(标称值):3.6V;稳压值(范围):3.4V~3.8V;功率:350mW;精度:-;; Supplier Part: C2113; Manufacturer: CJ(江苏长电/长晶); Supplier Footprint: SOD-123; JLCPCB Part Class: 扩展库; Datasheet: https://atta.szlcsc.com/upload/public/pdf/source/20140508/1457707057629.pdf; Supplier: LCSC; Diode Configuration: 独立式; Zener Voltage (Nom): 3.6V; Reverse Leakage Current (Ir): 5uA@1V; Zener Voltage (Range): 3.4V~3.8V; Power Dissipation: 350mW; Zener Impedance (Zzt): 90Ω
LED62-LED68 = XL-6028RGBW-WS2812B: 6028幻彩雾状（ws2812b); Supplier Part: C42163197; Manufacturer: XINGLIGHT(成兴光); Supplier Footprint: SMD-4P,3.2x2.8mm; JLCPCB Part Class: 扩展库; Datasheet: https://atta.szlcsc.com/upload/public/pdf/source/20241024/FC25C683F3142850CC3F64F8BA37BD57.pdf; Supplier: LCSC; Wavelength: 515nm；620nm~630nm；525nm; Luminous Intensity: 800mcd；150mcd；180mcd; Operating Temperature: -40℃~+85℃; Peak Wavelength: 525nm；475nm；625nm
LED105-LED148 = WS2812B-Mini_C527089: 发光颜色:RGB三色;二极管配置:-;透镜颜色:-;主波长:472nm；518nm；622nm;峰值波长:-;色温:-;光通量(25时):-;测试电流:12mA;正向电压(VF):-;发光强度:310mcd；780mcd；215mcd;功率:-;发光角度:-;安装方式:-;工作温度:-;; LCSC Part Name: RGB三色; Supplier Part: C527089; Manufacturer: worldsemi; Supplier Footprint: 3535(mm); JLCPCB Part Class: Extended Part; Datasheet: https://atta.szlcsc.com/upload/public/pdf/source/20190620/C114583_ECCAEB884D1CBA01F5696FFC90F90D84.pdf; Supplier: LCSC; Emitted Color: RGB三色; Dominant Wavelength: 472nm；518nm；622nm; Forward Current: 12mA; Luminous Intensity: 310mcd；780mcd；215mcd
C5 C18 C25-C27 = CC0603KRX7R9BB104: 容值:100nF;精度:±10%;额定电压:50V;温度系数:X7R;; LCSC Part Name: 100nF±10%50V; Supplier Part: C14663; Manufacturer: YAGEO(国巨); Supplier Footprint: 0603; JLCPCB Part Class: BasicPart; Datasheet: https://atta.szlcsc.com/upload/public/pdf/source/20170116/1484561234239.pdf; Supplier: LCSC; Tolerance: ±10%; Voltage Rated: 50V; Temperature Coefficient: X7R
C19-C23 C28-C32 = CL21A226MAQNNNE_C45783: 容值:22uF;精度:±20%;额定电压:25V;温度系数:X5R;; LCSC Part Name: 22uF±20%25V; Supplier Part: C45783; Manufacturer: SAMSUNG(三星); Manufacturer Part: CL21A226MAQNNNE; Supplier Footprint: 0805; JLCPCB Part Class: BasicPart; Datasheet: https://atta.szlcsc.com/upload/public/pdf/source/20160103/1457707727161.pdf; Supplier: LCSC; Tolerance: ±20%; Voltage Rated: 25V; Temperature Coefficient: X5R
CN3 CN4 = X0800WRS-03HF-LPV01: 参考系列:-;间距:0.8mm;插针结构:1x3P;排数:1;每排PIN数:3;行距:-;公母:公型插针;安装方式:卧贴;额定电流:500mA;工作温度范围:-25~+85;; LCSC Part Name: 0.8mm刺破连接器针座X0800HISMD卧贴3P镀金替代JST; Supplier Part: C500138; Manufacturer: XKBConnectivity(中国星坤); Supplier Footprint: SMD,P=0.8mm; JLCPCB Part Class: ExtendedPart; Datasheet: https://atta.szlcsc.com/upload/public/pdf/source/20211011/3A0802A09DD608D3DCC2D13C156B7911.pdf; Supplier: LCSC; Pitch: 0.8mm; Pins Structure: 1x3P; Number of Rows: 1; Number of PINs Per Row: 3; Gender: 公型插针; Mounting Style: 卧贴; Current Rating (Max): 500mA; Operating Temperature Range: -25~+85
D2-D4 D11-D13 = FR107: 二极管配置:独立式;直流反向耐压(Vr):1kV;平均整流电流(Io):1A;正向压降(Vf):1.3V@1A;反向电流(Ir):5A@1kV;反向恢复时间(trr):500ns;工作温度:-55~+150@(Tj);; LCSC Part Name: 1kV1A500ns; Supplier Part: C2760867; Manufacturer: Slkor(萨科微); Supplier Footprint: SOD-123FL; JLCPCB Part Class: ExtendedPart; Datasheet: https://atta.szlcsc.com/upload/public/pdf/source/20210316/C2760867_0B45AFF5F62837EEEC945A80EBBE02AA.pdf; Supplier: LCSC; Diode Configuration: 独立式; Reverse Voltage (Vr): 1kV; Average Rectified Current (Io): 1A; Forward Voltage (Vf@If): 1.3V@1A; Reverse Leakage Current: 5A@1kV; Reverse Recovery Time (trr): 500ns; Operating Temperature: -55~+150@(Tj)
D5-D10 D14-D19 = 1N4148W: 二极管配置:独立式;功率:400mW;直流反向耐压(Vr):75V;平均整流电流(Io):150mA;正向压降(Vf):1.25V@150mA;反向电流(Ir):1A@75V;反向恢复时间(trr):4ns;工作温度:+150@(Tj);; LCSC Part Name: 75V150mA4ns; Supplier Part: C81598; Manufacturer: ST(先科); Supplier Footprint: SOD-123; JLCPCB Part Class: BasicPart; Datasheet: https://atta.szlcsc.com/upload/public/pdf/source/20161024/1477288446905.pdf; Supplier: LCSC; Diode Configuration: 独立式; Power Dissipation: 400mW; Reverse Voltage (Vr): 75V; Average Rectified Current (Io): 150mA; Forward Voltage (Vf@If): 1.25V@150mA; Reverse Leakage Current: 1A@75V; Reverse Recovery Time (trr): 4ns; Operating Temperature: +150@(Tj)
Q12-Q23 = AP2300: 类型:N沟道;漏源电压(Vdss):20V;连续漏极电流(Id):5.2A;功率(Pd):1.25W;导通电阻(RDS(on)@Vgs,Id):35mΩ@2.5V,5.2A;阈值电压(Vgs(th)@Id):1.5V@250A;; LCSC Part Name: N沟道20V5.2A; Supplier Part: C360338; Manufacturer: ALLPOWER(铨力); Supplier Footprint: SOT-23; JLCPCB Part Class: ExtendedPart; Datasheet: https://atta.szlcsc.com/upload/public/pdf/source/20190107/C360338_4B377735A4378FD04B92CACA31EFF211.pdf; Supplier: LCSC; Type: N沟道; Drain Source Voltage (Vdss): 20V; Continuous Drain Current (Id): 5.2A; Power Dissipation (Pd): 1.25W; Drain Source On Resistance (RDS(on)@Vgs,Id): 35mΩ@2.5V,5.2A; Gate Threshold Voltage (Vgs(th)@Id): 1.5V@250A
R5 R6 R27-R30 R32-R37 = 0603WAF100JT5E: 电阻类型:厚膜电阻;阻值:10Ω;精度:±1%;功率:1/10W;温度系数:±400ppm/;最大工作电压:75V;工作温度范围:-55~+155;; LCSC Part Name: 10Ω±1%1/10W; Supplier Part: C22859; Manufacturer: UNI-ROYAL(厚声); Supplier Footprint: 0603; JLCPCB Part Class: BasicPart; Datasheet: https://atta.szlcsc.com/upload/public/pdf/source/20200306/C422600_1E6D84923E4A46A82E41ADD87F860B5C.pdf; Supplier: LCSC; Type: 厚膜电阻; Tolerance: ±1%; Power(Watts): 1/10W; Temperature Coefficient: ±400ppm/; Overload Voltage (Max): 75V; Operating Temperature Range: -55~+155
U9 U13 = EG2133: EG2133是一款高性价比的三相半桥驱动芯片，配合六颗Nmos可以组成三相直流无刷电机驱动器。包装为管装。; Supplier Part: C190343; Manufacturer: EG(屹晶微); Supplier Footprint: TSSOP-20; JLCPCB Part Class: ExtendedPart; Datasheet: https://atta.szlcsc.com/upload/public/pdf/source/20180420/C190343_D72E3A67AA6163C096C94C43999C7AB3.pdf; Supplier: LCSC
U10 U12 = MT6701CT-STD: 磁性编码器 磁性编码开关 磁性角度检测IC 可编程磁性角度位置芯片; LCSC Part Name: 霍尔在线编程角度位置传感器; Supplier Part: C2856764; Manufacturer: MagnTek(麦歌恩); Supplier Footprint: SOP-8; JLCPCB Part Class: ExtendedPart; Datasheet: https://atta.szlcsc.com/upload/public/pdf/source/20210901/89396AA55DF26524CEF7734A3D9C2FB3.pdf; Supplier: LCSC
U11 = PCA9543APWR: PCA9543A 具有中断、复位和电压转换功能的 2 通道 2.3V 至 5.5V I2C/SMBus 开关; Supplier Part: C2674066; Manufacturer: TI(德州仪器); Supplier Footprint: TSSOP-14; JLCPCB Part Class: Extended Part; Datasheet: http://www.ti.com/cn/lit/gpn/pca9543a; Supplier: LCSC

## Nets
5V: C13.2 C64.1 C65.1 C66.1 C67.2 C68.1 C69.1 C70.1 C71.2 C72.2 C73.2 C74.2 C76.2 C77.2 C78.2 C79.2 D20.1(K) L1.1 LED62.3(VDD) LED63.3(VDD) LED64.3(VDD) LED65.3(VDD) LED66.3(VDD) LED67.3(VDD) LED68.3(VDD) LED105.1(VDD) LED106.1(VDD) LED107.1(VDD) LED108.1(VDD) LED109.1(VDD) LED110.1(VDD) LED111.1(VDD) LED112.1(VDD) LED113.1(VDD) LED114.1(VDD) LED115.1(VDD) LED116.1(VDD) LED117.1(VDD) LED118.1(VDD) LED119.1(VDD) LED120.1(VDD) LED121.1(VDD) LED122.1(VDD) LED123.1(VDD) LED124.1(VDD) LED125.1(VDD) LED126.1(VDD) LED127.1(VDD) LED128.1(VDD) LED129.1(VDD) LED130.1(VDD) LED131.1(VDD) LED132.1(VDD) LED133.1(VDD) LED134.1(VDD) LED135.1(VDD) LED136.1(VDD) LED137.1(VDD) LED138.1(VDD) LED139.1(VDD) LED140.1(VDD) LED141.1(VDD) LED142.1(VDD) LED143.1(VDD) LED144.1(VDD) LED145.1(VDD) LED146.1(VDD) LED147.1(VDD) LED148.1(VDD) U2.3(VIN) U31.16(VCC) U38.4(EN) U38.5(IN) USB1.A4(VBUS) USB1.A9(VBUS) USB1.B4(VBUS) USB1.B9(VBUS)
12V: C5.1 C8.2 C9.2 C19.1 C20.2 C27.1 C28.1 C29.2 D1.1(K) D2.2(A) D3.2(A) D4.2(A) D11.2(A) D12.2(A) D13.2(A) D27.2 D28.2 D29.2 Q12.3(D) Q14.3(D) Q16.3(D) Q18.3(D) Q20.3(D) Q22.3(D) R16.2 R38.2 U9.7(VCC) U13.7(VCC)
+3.3V: C1.2 C2.2 C3.2 C4.2 C14.2 C17.2 C18.2 C25.2 C26.2 C75.2 D21.1(K) D23.1(K) D24.1(K) R26.1 R31.2 R39.2 U1.2(3V3) U2.2(VOUT) U8.7(VCC) U8.10(V3) U10.1(VDD) U10.2(MODE) U10.8(Z) U11.14(VCC) U12.1(VDD) U12.2(MODE) U12.8(Z) U30.1(VDD) U32.1(VDD) U33.1(VDD) U34.1(VDD) U35.1(VDD) U36.1(VDD) U37.1(VDD) ZD1.1(K)
GND: C1.1 C2.1 C3.1 C4.1 C5.2 C8.1 C9.1 C13.1 C14.1 C17.1 C18.1 C19.2 C20.1 C24.2 C25.1 C26.1 C27.2 C28.2 C29.1 C50.1 C51.1 C52.1 C53.1 C54.1 C55.1 C56.1 C64.2 C65.2 C66.2 C67.1 C68.2 C69.2 C70.2 C71.1 C72.1 C73.1 C74.1 C75.1 C76.1 C77.1 C78.1 C79.1 C80.1 C81.1 C82.1 C83.1 C84.1 C85.1 C86.1 C87.1 C88.1 C89.1 CN3.4 CN3.5 CN4.4 CN4.5 D20.2(A) D21.2(A) D23.2(A) D24.2(A) D27.1 D28.1 D29.1 LED2.1(K) LED3.1(K) LED62.1(GND) LED63.1(GND) LED64.1(GND) LED65.1(GND) LED66.1(GND) LED67.1(GND) LED68.1(GND) LED105.3(VSS) LED106.3(VSS) LED107.3(VSS) LED108.3(VSS) LED109.3(VSS) LED110.3(VSS) LED111.3(VSS) LED112.3(VSS) LED113.3(VSS) LED114.3(VSS) LED115.3(VSS) LED116.3(VSS) LED117.3(VSS) LED118.3(VSS) LED119.3(VSS) LED120.3(VSS) LED121.3(VSS) LED122.3(VSS) LED123.3(VSS) LED124.3(VSS) LED125.3(VSS) LED126.3(VSS) LED127.3(VSS) LED128.3(VSS) LED129.3(VSS) LED130.3(VSS) LED131.3(VSS) LED132.3(VSS) LED133.3(VSS) LED134.3(VSS) LED135.3(VSS) LED136.3(VSS) LED137.3(VSS) LED138.3(VSS) LED139.3(VSS) LED140.3(VSS) LED141.3(VSS) LED142.3(VSS) LED143.3(VSS) LED144.3(VSS) LED145.3(VSS) LED146.3(VSS) LED147.3(VSS) LED148.3(VSS) Q13.2(S) Q15.2(S) Q17.2(S) Q19.2(S) Q21.2(S) Q23.2(S) R3.1 R51.1 R52.1 R53.1 R54.1 R55.1 R56.1 R57.1 R58.1 R59.1 R60.1 R61.1 R62.2 U1.1(GND) U1.40(GND) U1.41(GND) U2.1(VSS) U8.3(GND) U9.8(GND) U10.4(GND) U11.1(A0) U11.2(A1) U11.7(GND) U12.4(GND) U13.8(GND) U30.2(GND) U31.6(#ENABLE) U31.8(GND) U32.2(GND) U33.2(GND) U34.2(GND) U35.2(GND) U36.2(GND) U37.2(GND) U38.2(GND) USB1.A1(GND) USB1.A12(GND) USB1.B1(GND) USB1.B12(GND) ZD1.2(A)
ADC1: U1.12(IO8) U31.13(X)
ADC2: U1.21(IO13) U31.3(Y)
BT_1: C51.2 U31.1(Y0) U32.3(VOUT)
BT_2: C52.2 U31.5(Y1) U33.3(VOUT)
BT_3: C53.2 U31.2(Y2) U34.3(VOUT)
BT_4: C54.2 U31.4(Y3) U35.3(VOUT)
D+: U8.1(UD+) USB1.A6(DP1) USB1.B6(DP2)
D-: U8.2(UD-) USB1.A7(DN1) USB1.B7(DN2)
EN: R26.2 U1.3(EN) U8.4(RTS#)
FX_L: C55.2 U31.12(X0) U36.3(VOUT)
FX_R: C56.2 U31.14(X1) U37.3(VOUT)
HO1_0: D10.1(K) R27.1 U9.19(HO1)
HO1_1: D14.1(K) R32.1 U13.19(HO1)
HO2_0: D6.1(K) R5.1 U9.16(HO2)
HO2_1: D16.1(K) R34.1 U13.16(HO2)
HO3_0: D8.1(K) R29.1 U9.13(HO3)
HO3_1: D18.1(K) R36.1 U13.13(HO3)
IO0: R25.2 U1.27(IO0) U8.6(TNOW/DTR#)
IO_ON_OFF: U1.11(IO18)
LED: LED62.2(DI) LED148.2(DOUT)
LO1_0: D5.1(K) R28.1 U9.11(LO1)
LO1_1: D15.1(K) R33.1 U13.11(LO1)
LO2_0: D7.1(K) R6.1 U9.10(LO2)
LO2_1: D17.1(K) R35.1 U13.10(LO2)
LO3_0: D9.1(K) R30.1 U9.9(LO3)
LO3_1: D19.1(K) R37.1 U13.9(LO3)
M0_IN1_0: U1.10(IO17) U9.1(HIN1) U9.4(LIN1#)
M0_IN1_1: U1.18(IO10) U13.1(HIN1) U13.4(LIN1#)
M0_IN2_0: U1.9(IO16) U9.2(HIN2) U9.5(LIN2#)
M0_IN2_1: U1.19(IO11) U13.2(HIN2) U13.5(LIN2#)
M0_IN3_0: U1.8(IO15) U9.3(HIN3) U9.6(LIN3#)
M0_IN3_1: U1.20(IO12) U13.3(HIN3) U13.6(LIN3#)
RGB_IN: LED105.4(DIN) U1.31(IO38)
RXD0: U1.36(RXD0) U8.8(TXD)
SCL: U1.38(IO2) U11.12(SCL)
SCL_0: U10.7(B) U11.6(SC0)
SCL_1: U11.10(SC1) U12.7(B)
SDA: U1.39(IO1) U11.13(SDA)
SDA_0: U10.6(A) U11.5(SD0)
SDA_1: U11.9(SD1) U12.6(A)
SEL1: U1.33(IO40) U31.9(B)
SEL2: U1.34(IO41) U31.10(A)
START: C50.2 U30.3(VOUT) U31.15(X2)
TXD0: U1.37(TXD0) U8.9(RXD)
VS1_0: C21.1 CN3.1 Q12.2(S) Q13.3(D) U9.18(VS1)
VS1_1: C30.1 CN4.1 Q18.2(S) Q19.3(D) U13.18(VS1)
VS2_0: C22.1 CN3.2 Q14.2(S) Q15.3(D) U9.15(VS2)
VS2_1: C31.1 CN4.2 Q20.2(S) Q21.3(D) U13.15(VS2)
VS3_0: C23.1 CN3.3 Q16.2(S) Q17.3(D) U9.12(VS3)
VS3_1: C32.1 CN4.3 Q22.2(S) Q23.3(D) U13.12(VS3)
$1N73590: R62.1 USB1.B5(CC2)
$1N73594: C89.2 R60.2 USB1.1(EP) USB1.2(EP) USB1.3(EP) USB1.4(EP)
$1N73687: R61.2 USB1.A5(CC1)
$1N81610: R25.1 U8.5(CTS#)
$1N109096: D1.2(A) L1.2 U38.1(SW)
$1N109097: R3.2 R38.1 U38.3(FB)
$1N109534: LED2.2(A) R39.1
$1N109538: LED3.2(A) R16.1
$1N114107: C80.2 R51.2
$1N114111: C81.2 R52.2
$1N114116: C82.2 R53.2
$1N114121: C83.2 R54.2
$1N114126: C85.2 R58.2
$1N114131: C86.2 R57.2
$1N114136: C87.2 R56.2
$1N114141: C88.2 R55.2
$1N114146: C84.2 R59.2
$4N3014: D9.2(A) Q17.1(G) R30.2
$4N3016: D8.2(A) Q16.1(G) R29.2
$4N3025: D7.2(A) Q15.1(G) R6.2
$4N3026: D6.2(A) Q14.1(G) R5.2
$4N3028: D5.2(A) Q13.1(G) R28.2
$4N3032: D10.2(A) Q12.1(G) R27.2
$4N3039: C32.2 D13.1(K) U13.14(VB3)
$4N3040: C31.2 D12.1(K) U13.17(VB2)
$4N3041: C30.2 D11.1(K) U13.20(VB1)
$4N3058: C21.2 D2.1(K) U9.20(VB1)
$4N3059: C22.2 D3.1(K) U9.17(VB2)
$4N3060: C23.2 D4.1(K) U9.14(VB3)
$4N3066: D19.2(A) Q23.1(G) R37.2
$4N3069: D18.2(A) Q22.1(G) R36.2
$4N3076: D16.2(A) Q20.1(G) R34.2
$4N3078: D17.2(A) Q21.1(G) R35.2
$4N3091: D15.2(A) Q19.1(G) R33.2
$4N3095: D14.2(A) Q18.1(G) R32.2
$4N5344: C24.1 R31.1 U11.3(RESET#)
$5N3636: LED64.4(DO) LED65.2(DI)
$5N3697: LED66.4(DO) LED67.2(DI)
$5N3701: LED67.4(DO) LED68.2(DI)
$5N3703: LED65.4(DO) LED66.2(DI)
$5N3707: LED62.4(DO) LED63.2(DI)
$5N3711: LED63.4(DO) LED64.2(DI)
$5N6773: LED105.2(DOUT) LED106.4(DIN)
$5N6774: LED106.2(DOUT) LED107.4(DIN)
$5N6775: LED107.2(DOUT) LED108.4(DIN)
$5N7027: LED111.2(DOUT) LED112.4(DIN)
$5N7029: LED110.2(DOUT) LED111.4(DIN)
$5N7032: LED109.2(DOUT) LED110.4(DIN)
$5N7047: LED108.2(DOUT) LED109.4(DIN)
$5N7558: LED114.2(DOUT) LED115.4(DIN)
$5N7559: LED113.2(DOUT) LED114.4(DIN)
$5N7562: LED112.2(DOUT) LED113.4(DIN)
$5N7565: LED115.2(DOUT) LED116.4(DIN)
$5N7580: LED119.2(DOUT) LED120.4(DIN)
$5N7581: LED118.2(DOUT) LED119.4(DIN)
$5N7582: LED117.2(DOUT) LED118.4(DIN)
$5N7585: LED116.2(DOUT) LED117.4(DIN)
$5N8582: LED134.2(DOUT) LED135.4(DIN)
$5N8597: LED132.2(DOUT) LED133.4(DIN)
$5N8598: LED135.2(DOUT) LED136.4(DIN)
$5N8600: LED133.2(DOUT) LED134.4(DIN)
$5N8604: LED131.2(DOUT) LED132.4(DIN)
$5N8606: LED130.2(DOUT) LED131.4(DIN)
$5N8621: LED129.2(DOUT) LED130.4(DIN)
$5N8622: LED128.2(DOUT) LED129.4(DIN)
$5N8636: LED126.2(DOUT) LED127.4(DIN)
$5N8638: LED125.2(DOUT) LED126.4(DIN)
$5N8640: LED124.2(DOUT) LED125.4(DIN)
$5N8642: LED122.2(DOUT) LED123.4(DIN)
$5N8657: LED121.2(DOUT) LED122.4(DIN)
$5N8660: LED120.2(DOUT) LED121.4(DIN)
$5N8661: LED127.2(DOUT) LED128.4(DIN)
$5N8663: LED123.2(DOUT) LED124.4(DIN)
$5N9423: LED146.2(DOUT) LED147.4(DIN)
$5N9437: LED147.2(DOUT) LED148.4(DIN)
$5N9438: LED144.2(DOUT) LED145.4(DIN)
$5N9442: LED145.2(DOUT) LED146.4(DIN)
$5N9458: LED143.2(DOUT) LED144.4(DIN)
$5N9459: LED142.2(DOUT) LED143.4(DIN)
$5N9461: LED141.2(DOUT) LED142.4(DIN)
$5N9463: LED140.2(DOUT) LED141.4(DIN)
$5N9466: LED139.2(DOUT) LED140.4(DIN)
$5N9480: LED138.2(DOUT) LED139.4(DIN)
$5N9483: LED136.2(DOUT) LED137.4(DIN)
$5N9485: LED137.2(DOUT) LED138.4(DIN)

Not connected (* = marked no-connect by the designer): LED68 4(DO)*; U1 4(IO4) 5(IO5) 6(IO6) 7(IO7) 13(IO19) 14(IO20) 15(IO3) 16(IO46) 17(IO9) 22(IO14) 23(IO21) 24(IO47) 25(IO48) 26(IO45) 28(IO35) 29(IO36) 30(IO37) 32(IO39) 35(IO42); U10 3(OUT)* 5(PUSH)*; U11 4(INT0#)* 8(INT1#)* 11(INT#)*; U12 3(OUT)* 5(PUSH)*; U31 7(NC)* 11(X3)*; U38 6(NC); USB1 A8(SUB1)* B8(SUB2)*

## Notes on the sheets
sheet 1
- Vref=0.6V
  33k：10.5V
  30k：9.6V
  27k：8.7V
- ESP32
- USB电路5V充电
- 电源
- 自动下载
- 键盘
sheet 2
- 电机驱动电路0
- 磁编码器0
- 电机驱动电路1
- 磁编码器1
- 5-15V电压输入
- 5-15V电压输入
- IIC复用
sheet 3
- 44颗正贴
- 7颗反贴
